# EAGLE schematic Multiplex (EAGLE 9.5.1)
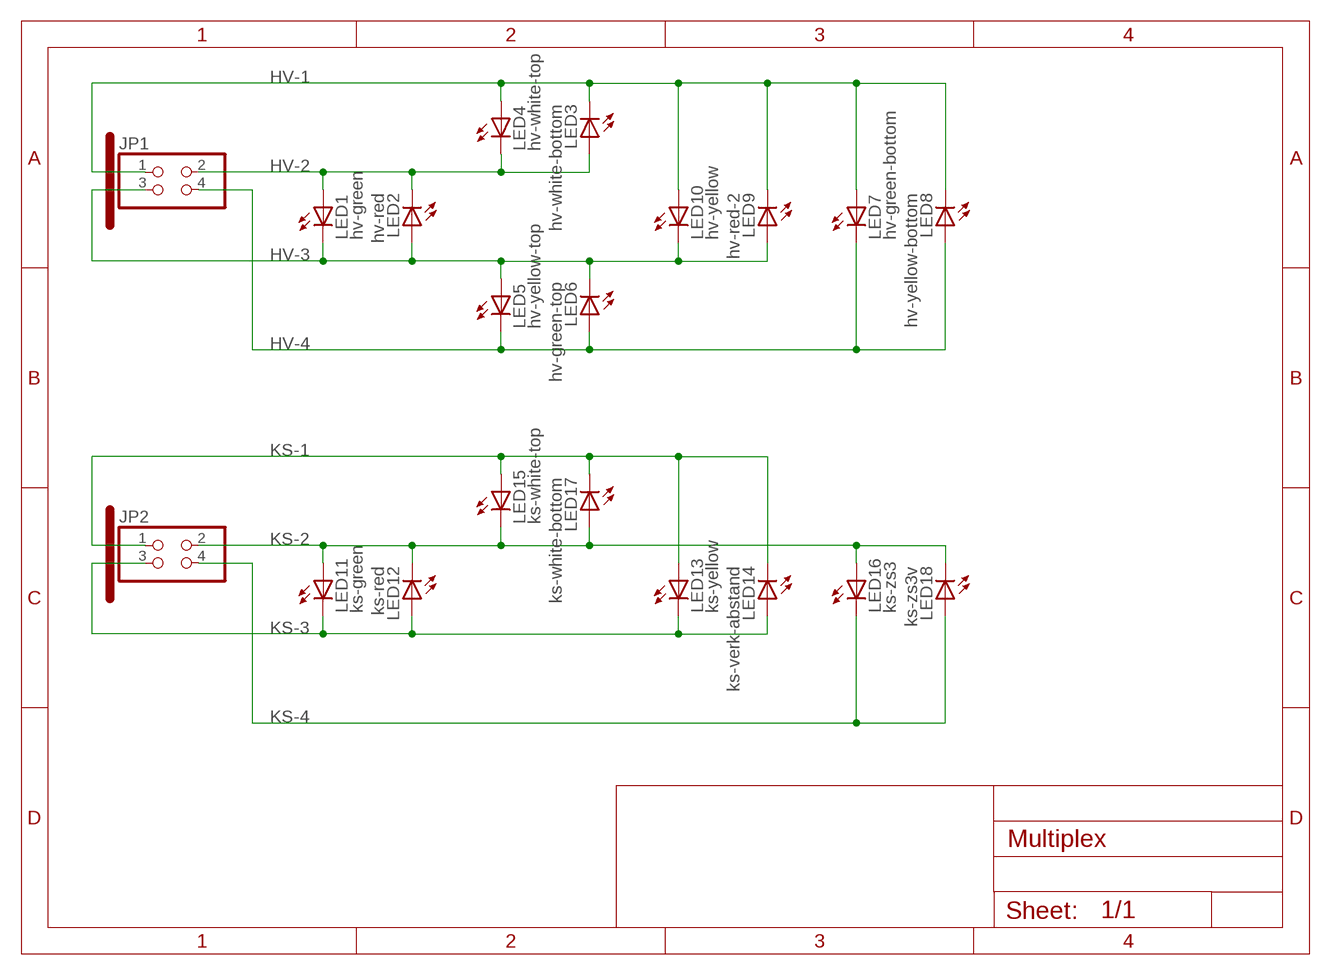
[diagram p0: schematic, sheet 1]

## Parts
JP1  PINHD-2X2  [2X02]
JP2  PINHD-2X2  [2X02]
LED1  hv-green  LED3MM  [LED3MM]
LED2  hv-red  LED3MM  [LED3MM]
LED3  hv-white-bottom  LED3MM  [LED3MM]
LED4  hv-white-top  LED3MM  [LED3MM]
LED5  hv-yellow-top  LED3MM  [LED3MM]
LED6  hv-green-top  LED3MM  [LED3MM]
LED7  hv-green-bottom  LED3MM  [LED3MM]
LED8  hv-yellow-bottom  LED3MM  [LED3MM]
LED9  hv-red-2  LED3MM  [LED3MM]
LED10  hv-yellow  LED3MM  [LED3MM]
LED11  ks-green  LED3MM  [LED3MM]
LED12  ks-red  LED3MM  [LED3MM]
LED13  ks-yellow  LED3MM  [LED3MM]
LED14  ks-verk-abstand  LED3MM  [LED3MM]
LED15  ks-white-top  LED3MM  [LED3MM]
LED16  ks-zs3  LED3MM  [LED3MM]
LED17  ks-white-bottom  LED3MM  [LED3MM]
LED18  ks-zs3v  LED3MM  [LED3MM]

## Nets
HV-1: JP1.1 LED3.K(C) LED4.A LED7.A LED8.K(C) LED9.K(C) LED10.A
HV-2: JP1.2 LED1.A LED2.K(C) LED3.A LED4.K(C)
HV-3: JP1.3 LED1.K(C) LED2.A LED5.A LED6.K(C) LED9.A LED10.K(C)
HV-4: JP1.4 LED5.K(C) LED6.A LED7.K(C) LED8.A
KS-1: JP2.1 LED13.A LED14.K(C) LED15.A LED17.K(C)
KS-2: JP2.2 LED11.A LED12.K(C) LED15.K(C) LED16.A LED17.A LED18.K(C)
KS-3: JP2.3 LED11.K(C) LED12.A LED13.K(C) LED14.A
KS-4: JP2.4 LED16.K(C) LED18.A

## Library data of the parts
JP1 JP2 = pinhead:PINHD-2X2: PIN HEADER
LED1-LED18 = led:LED: LED OSRAM: - CHIPLED LG R971, LG N971, LY N971, LG Q971, LY Q971, LO R971, LY R971 LH N974, LH R974 LS Q976, LO Q976, LY Q976 LO Q996 - Hyper CHIPLED LW Q18S LB Q993, LB Q99A, LB R99A - SideLED LS A670, LO A670, LY A670, LG A670, LP A670 LB A673, LV A673, LT A673, LW A673 LH A674 LY A675 LS A676, LA A676, LO A676, LY A676, LW A676 LS A679, LY A679, LG A679 - Hyper Micro SIDELED® LS Y876, LA Y876, LO Y876, LY Y876 LT Y87S - SmartLED LW L88C, LW L88S LB L89C, LB L89S, LG L890 LS L89K, LO L89K, LY L89K LS L896, LA L896, LO L896, LY L896 - TOPLED LS T670, LO T670, LY T670, LG T670, LP T670 LSG T670, LSP T670, LSY T670, LOP T670, LYG T670 LG T671, LOG T671, LSG T671 LB T673, LV T673, LT T673, LW T673 LH T674 LS T676, LA T676, LO T676, LY T676, LB T676, LH T676, LSB T676, LW T676 LB T67C, LV T67C, LT T67C, LS T67K, LO T67K, LY T67K, LW E67C LS E67B, LA E67B, LO E67B, LY E67B, LB E67C, LV E67C, LT E67C LW T67C LS T679, LY T679, LG T679 LS T770, LO T770, LY T770, LG T770, LP T770 LB T773, LV T773, LT T773, LW T773 LH T774 LS E675, LA E675, LY E675, LS T675 LS T776, LA T776, LO T776, LY T776, LB T776 LHGB T686 LT T68C, LB T68C - Hyper Mini TOPLED® LB M676 - Mini TOPLED Santana® LG M470 LS M47K, LO M47K, LY M47K Source: http://www.osram.convergy.de LUXEON: - LUMILED® LXK2-PW12-R00, LXK2-PW12-S00, LXK2-PW14-U00, LXK2-PW14-V00 LXK2-PM12-R00, LXK2-PM12-S00, LXK2-PM14-U00 LXK2-PE12-Q00, LXK2-PE12-R00, LXK2-PE12-S00, LXK2-PE14-T00, LXK2-PE14-U00 LXK2-PB12-K00, LXK2-PB12-L00, LXK2-PB12-M00, LXK2-PB14-N00, LXK2-PB14-P00, LXK2-PB14-Q00 LXK2-PR12-L00, LXK2-PR12-M00, LXK2-PR14-Q00, LXK2-PR14-R00 LXK2-PD12-Q00, LXK2-PD12-R00, LXK2-PD12-S00 LXK2-PH12-R00, LXK2-PH12-S00 LXK2-PL12-P00, LXK2-PL12-Q00, LXK2-PL12-R00 Source: www.luxeon.com KINGBRIGHT: KA-3528ASYC Source: www.kingbright.com